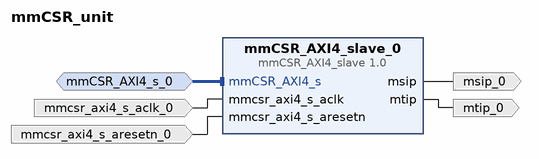
[diagram p0: block diagram of the top level]
# Vivado block design mmCSR_unit, xc7z020clg400-1, Vivado 2020.2
create_bd_design mmCSR_unit

create_bd_intf_port -mode Slave -vlnv xilinx.com:interface:aximm_rtl:1.0 mmCSR_AXI4_s_0
set_property -dict [list \
  CONFIG.ADDR_WIDTH 5 \
  CONFIG.ARUSER_WIDTH 0 \
  CONFIG.AWUSER_WIDTH 0 \
  CONFIG.BUSER_WIDTH 0 \
  CONFIG.DATA_WIDTH 32 \
  CONFIG.HAS_BRESP 1 \
  CONFIG.HAS_BURST 0 \
  CONFIG.HAS_CACHE 0 \
  CONFIG.HAS_LOCK 0 \
  CONFIG.HAS_PROT 1 \
  CONFIG.HAS_QOS 0 \
  CONFIG.HAS_REGION 0 \
  CONFIG.HAS_RRESP 1 \
  CONFIG.HAS_WSTRB 1 \
  CONFIG.ID_WIDTH 0 \
  CONFIG.MAX_BURST_LENGTH 1 \
  CONFIG.NUM_READ_OUTSTANDING 1 \
  CONFIG.NUM_READ_THREADS 1 \
  CONFIG.NUM_WRITE_OUTSTANDING 1 \
  CONFIG.NUM_WRITE_THREADS 1 \
  CONFIG.PROTOCOL AXI4LITE \
  CONFIG.READ_WRITE_MODE READ_WRITE \
  CONFIG.RUSER_BITS_PER_BYTE 0 \
  CONFIG.RUSER_WIDTH 0 \
  CONFIG.SUPPORTS_NARROW_BURST 0 \
  CONFIG.WUSER_BITS_PER_BYTE 0 \
  CONFIG.WUSER_WIDTH 0 \
] [get_bd_intf_ports mmCSR_AXI4_s_0]
create_bd_port -dir I -type clk mmcsr_axi4_s_aclk_0
create_bd_port -dir I -type rst mmcsr_axi4_s_aresetn_0
create_bd_port -dir O msip_0
create_bd_port -dir O mtip_0

create_bd_cell -type ip -vlnv user.org:user:mmCSR_AXI4_slave:1.0 mmCSR_AXI4_slave_0

# ---- connections ----

connect_bd_intf_net -intf_net mmCSR_AXI4_s_0_1 [get_bd_intf_ports mmCSR_AXI4_s_0] [get_bd_intf_pins mmCSR_AXI4_slave_0/mmCSR_AXI4_s]
connect_bd_net -net mmcsr_axi4_s_aclk_0_1 [get_bd_ports mmcsr_axi4_s_aclk_0] [get_bd_pins mmCSR_AXI4_slave_0/mmcsr_axi4_s_aclk]
connect_bd_net -net mmcsr_axi4_s_aresetn_0_1 [get_bd_ports mmcsr_axi4_s_aresetn_0] [get_bd_pins mmCSR_AXI4_slave_0/mmcsr_axi4_s_aresetn]
connect_bd_net [get_bd_pins mmCSR_AXI4_slave_0/msip] [get_bd_ports msip_0]
connect_bd_net [get_bd_pins mmCSR_AXI4_slave_0/mtip] [get_bd_ports mtip_0]

validate_bd_design
save_bd_design
